# EAGLE schematic bq24650_charger (EAGLE 8.6.3)
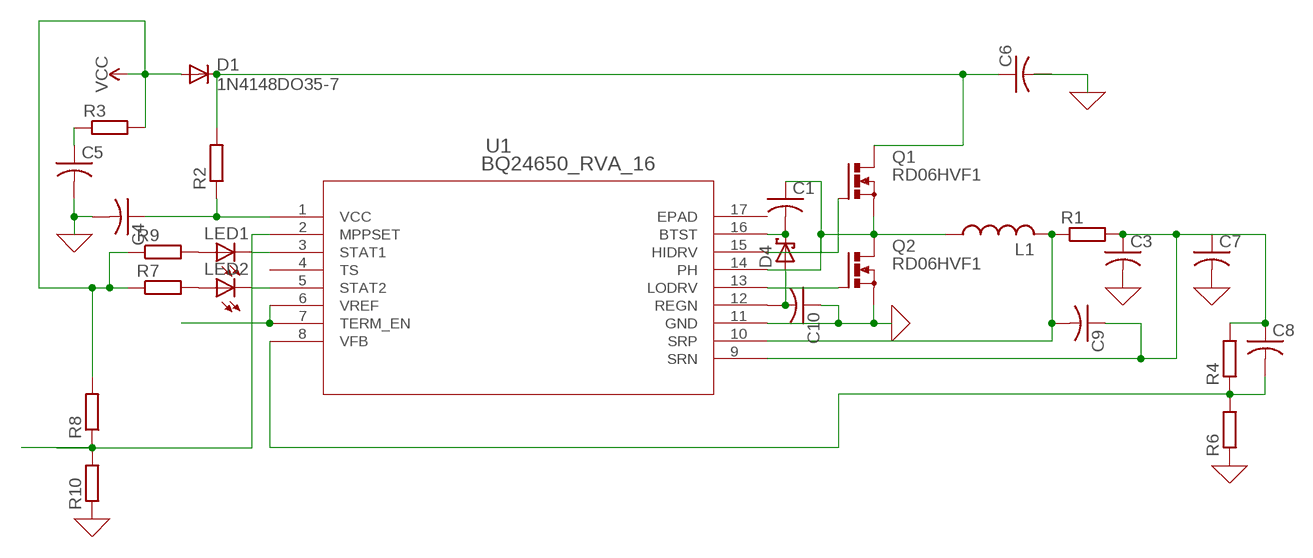
[diagram p0: schematic, sheet 1]

## Parts
C1  C-USC2220K  [C2220K]
C3  C-USC2220K  [C2220K]
C4  C-USC2220K  [C2220K]
C5  C-USC2220K  [C2220K]
C6  C-USC2220K  [C2220K]
C7  C-USC2220K  [C2220K]
C8  C-USC2220K  [C2220K]
C9  C-USC2220K  [C2220K]
C10  C-USC2220K  [C2220K]
D1  1N4148DO35-7  [DO35-7]
D4  SCHOTTKY-DIODECB429-15  [CB429-15]
L1  L-US0204/5  [0204/5]
LED1  LED  [SMARTLED-TTW]
LED2  LED  [SMARTLED-TTW]
Q1  RD06HVF1  [RD06HVF1]
Q2  RD06HVF1  [RD06HVF1]
R1  R  [R0805]
R2  R  [R0805]
R3  R  [R0805]
R4  R  [R0805]
R6  R  [R0805]
R7  R  [R0805]
R8  R  [R0805]
R9  R  [R0805]
R10  R  [R0805]
U1  BQ24650_RVA_16  [RVA16_2P14X2P14]

## Nets
0: C3.2 C4.2 C5.2 C7.2 C10.1 Q2.2(S) R6.1 R10.1 U1.11(GND) ; supply symbol labelled GND
N$1: C4.1 R2.1 U1.1(VCC)
N$2: C6.1 D1.C Q1.3(D) R2.2
N$3: C5.1 R3.1
N$4: C1.1 L1.1 Q1.1(G) Q1.2(S) Q2.3(D) U1.14(PH) U1.15(HIDRV)
N$5: Q2.1(G) U1.13(LODRV)
N$6: LED1.A@1(A) R9.2
N$7: C9.2 L1.2 R1.1 U1.10(SRP)
N$8: C3.1 C7.1 C8.1 C9.1 R1.2 R4.2 U1.9(SRN)
N$9: C10.2 U1.12(REGN)
N$10: C8.2 R4.1 R6.2 U1.8(VFB)
N$11: C1.2 D4.C U1.16(BTST)
N$12: D4.A
N$13: LED2.A@1(A) R7.2
N$14: LED1.C@1(C) U1.3(STAT1)
N$15: LED2.C@1(C) U1.5(STAT2)
N$16: U1.6(VREF) U1.7(TERM_EN)
N$17: R8.1 R10.2 U1.2(MPPSET)
VCC: D1.A R3.2 R7.1 R8.2 R9.1
Unconnected: C6.2 U1.4(TS)

## Power pins joined to a net without a drawn wire
EPAD: U1.17(EPAD)

## Library data of the parts
C1 C3-C10 = adafruit:C-US: CAPACITOR, American symbol
D1 = diode:1N4148: DIODE high speed (Philips)
D4 = adafruit:SCHOTTKY-DIODE: Schottky Diode
L1 = rcl:L-US: INDUCTOR, American symbol; SPICEPREFIX: L
LED1 LED2 = adafruit:LED: LED OSRAM: - CHIPLED LG R971, LG N971, LY N971, LG Q971, LY Q971, LO R971, LY R971 LH N974, LH R974 LS Q976, LO Q976, LY Q976 LO Q996 - Hyper CHIPLED LW Q18S LB Q993, LB Q99A, LB R99A - SideLED LS A670, LO A670, LY A670, LG A670, LP A670 LB A673, LV A673, LT A673, LW A673 LH A674 LY A675 LS A676, LA A676, LO A676, LY A676, LW A676 LS A679, LY A679, LG A679 - Hyper Micro SIDELED® LS Y876, LA Y876, LO Y876, LY Y876 LT Y87S - SmartLED LW L88C, LW L88S LB L89C, LB L89S, LG L890 LS L89K, LO L89K, LY L89K LS L896, LA L896, LO L896, LY L896 - TOPLED LS T670, LO T670, LY T670, LG T670, LP T670 LSG T670, LSP T670, LSY T670, LOP T670, LYG T670 LG T671, LOG T671, LSG T671 LB T673, LV T673, LT T673, LW T673 LH T674 LS T676, LA T676, LO T676, LY T676, LB T676, LH T676, LSB T676, LW T676 LB T67C, LV T67C, LT T67C, LS T67K, LO T67K, LY T67K, LW E67C LS E67B, LA E67B, LO E67B, LY E67B, LB E67C, LV E67C, LT E67C LW T67C LS T679, LY T679, LG T679 LS T770, LO T770, LY T770, LG T770, LP T770 LB T773, LV T773, LT T773, LW T773 LH T774 LS E675, LA E675, LY E675, LS T675 LS T776, LA T776, LO T776, LY T776, LB T776 LHGB T686 LT T68C, LB T68C - Hyper Mini TOPLED® LB M676 - Mini TOPLED Santana® LG M470 LS M47K, LO M47K, LY M47K Source: http://www.osram.convergy.de/
Q1 Q2 = transistor-power:RD06HVF1: RF Power MOSFET Transistor 175MHz,6W Source: MITSUBISHI .. rd06hvf1.pdf
R1-R4 R6-R10 = eagle-ltspice:R: RESISTOR, European symbol; SPICEMODEL: NONE; SPICEPREFIX: R
U1 = bq24650:BQ24650_RVA_16: Solar Li-Ion Battery Charge Controller; DATASHEETURL: httpwww.ti.comlitgpnBQ24650; FAMILY_NAME: BATTERY CHARGE MANAGEMENT; GENERIC_PART_NUMBER: BQ24650; INDUSTRY_STD_PKG_TYPE: VQFN; MANUFACTURER: Texas Instruments; PACKAGE_DESIGNATOR: RVA; PIN_COUNT: 16